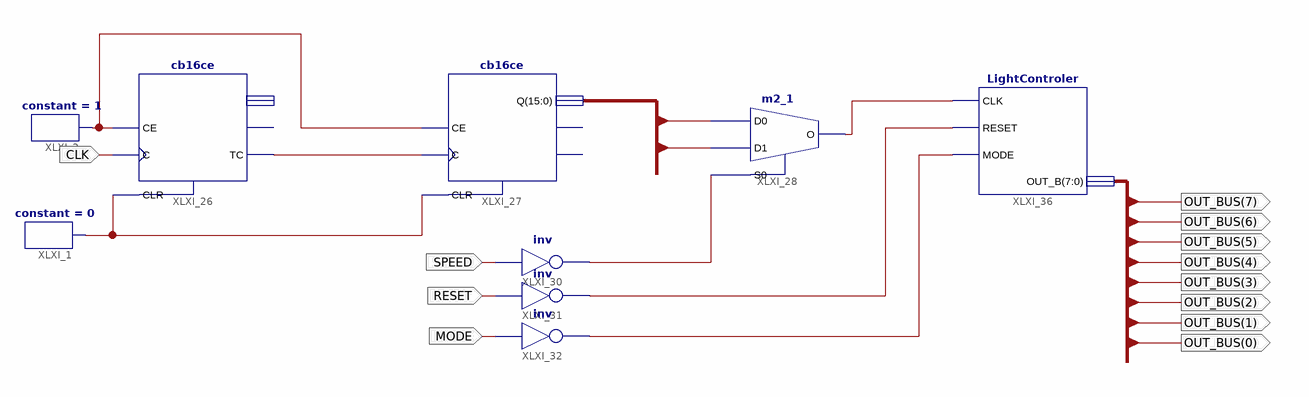
[diagram p0: schematic sheet 1]
// Xilinx ISE schematic fsfsdsd.sch (spartan3a) as structural Verilog: 9 symbols, 12 ports
module fsfsdsd (
  input  CLK,
  input  SPEED,
  input  RESET,
  input  MODE,
  output [7:0] OUT_BUS
);

  wire XLXN_107, XLXN_109, XLXN_121, XLXN_125, XLXN_126, XLXN_129, XLXN_130;
  wire [15:0] CNT_BUS;

  constant #(.CValue("0")) XLXI_1 (.O(XLXN_109));
  constant #(.CValue("1")) XLXI_2 (.O(XLXN_107));
  cb16ce XLXI_26 (.C(CLK), .CE(XLXN_107), .CLR(XLXN_109), .TC(XLXN_121));  // open: CEO, Q
  cb16ce XLXI_27 (.C(XLXN_121), .CE(XLXN_107), .CLR(XLXN_109), .Q(CNT_BUS));  // open: CEO, TC
  m2_1 XLXI_28 (.D0(CNT_BUS[4]), .D1(CNT_BUS[2]), .S0(XLXN_125), .O(XLXN_126));
  not XLXI_30 (XLXN_125, SPEED);
  not XLXI_31 (XLXN_129, RESET);
  not XLXI_32 (XLXN_130, MODE);
  LightControler XLXI_36 (.CLK(XLXN_126), .RESET(XLXN_129), .MODE(XLXN_130), .OUT_B(OUT_BUS));
endmodule
